# EasyEDA Pro project MicroMouse_v02.eprj, board PCB1
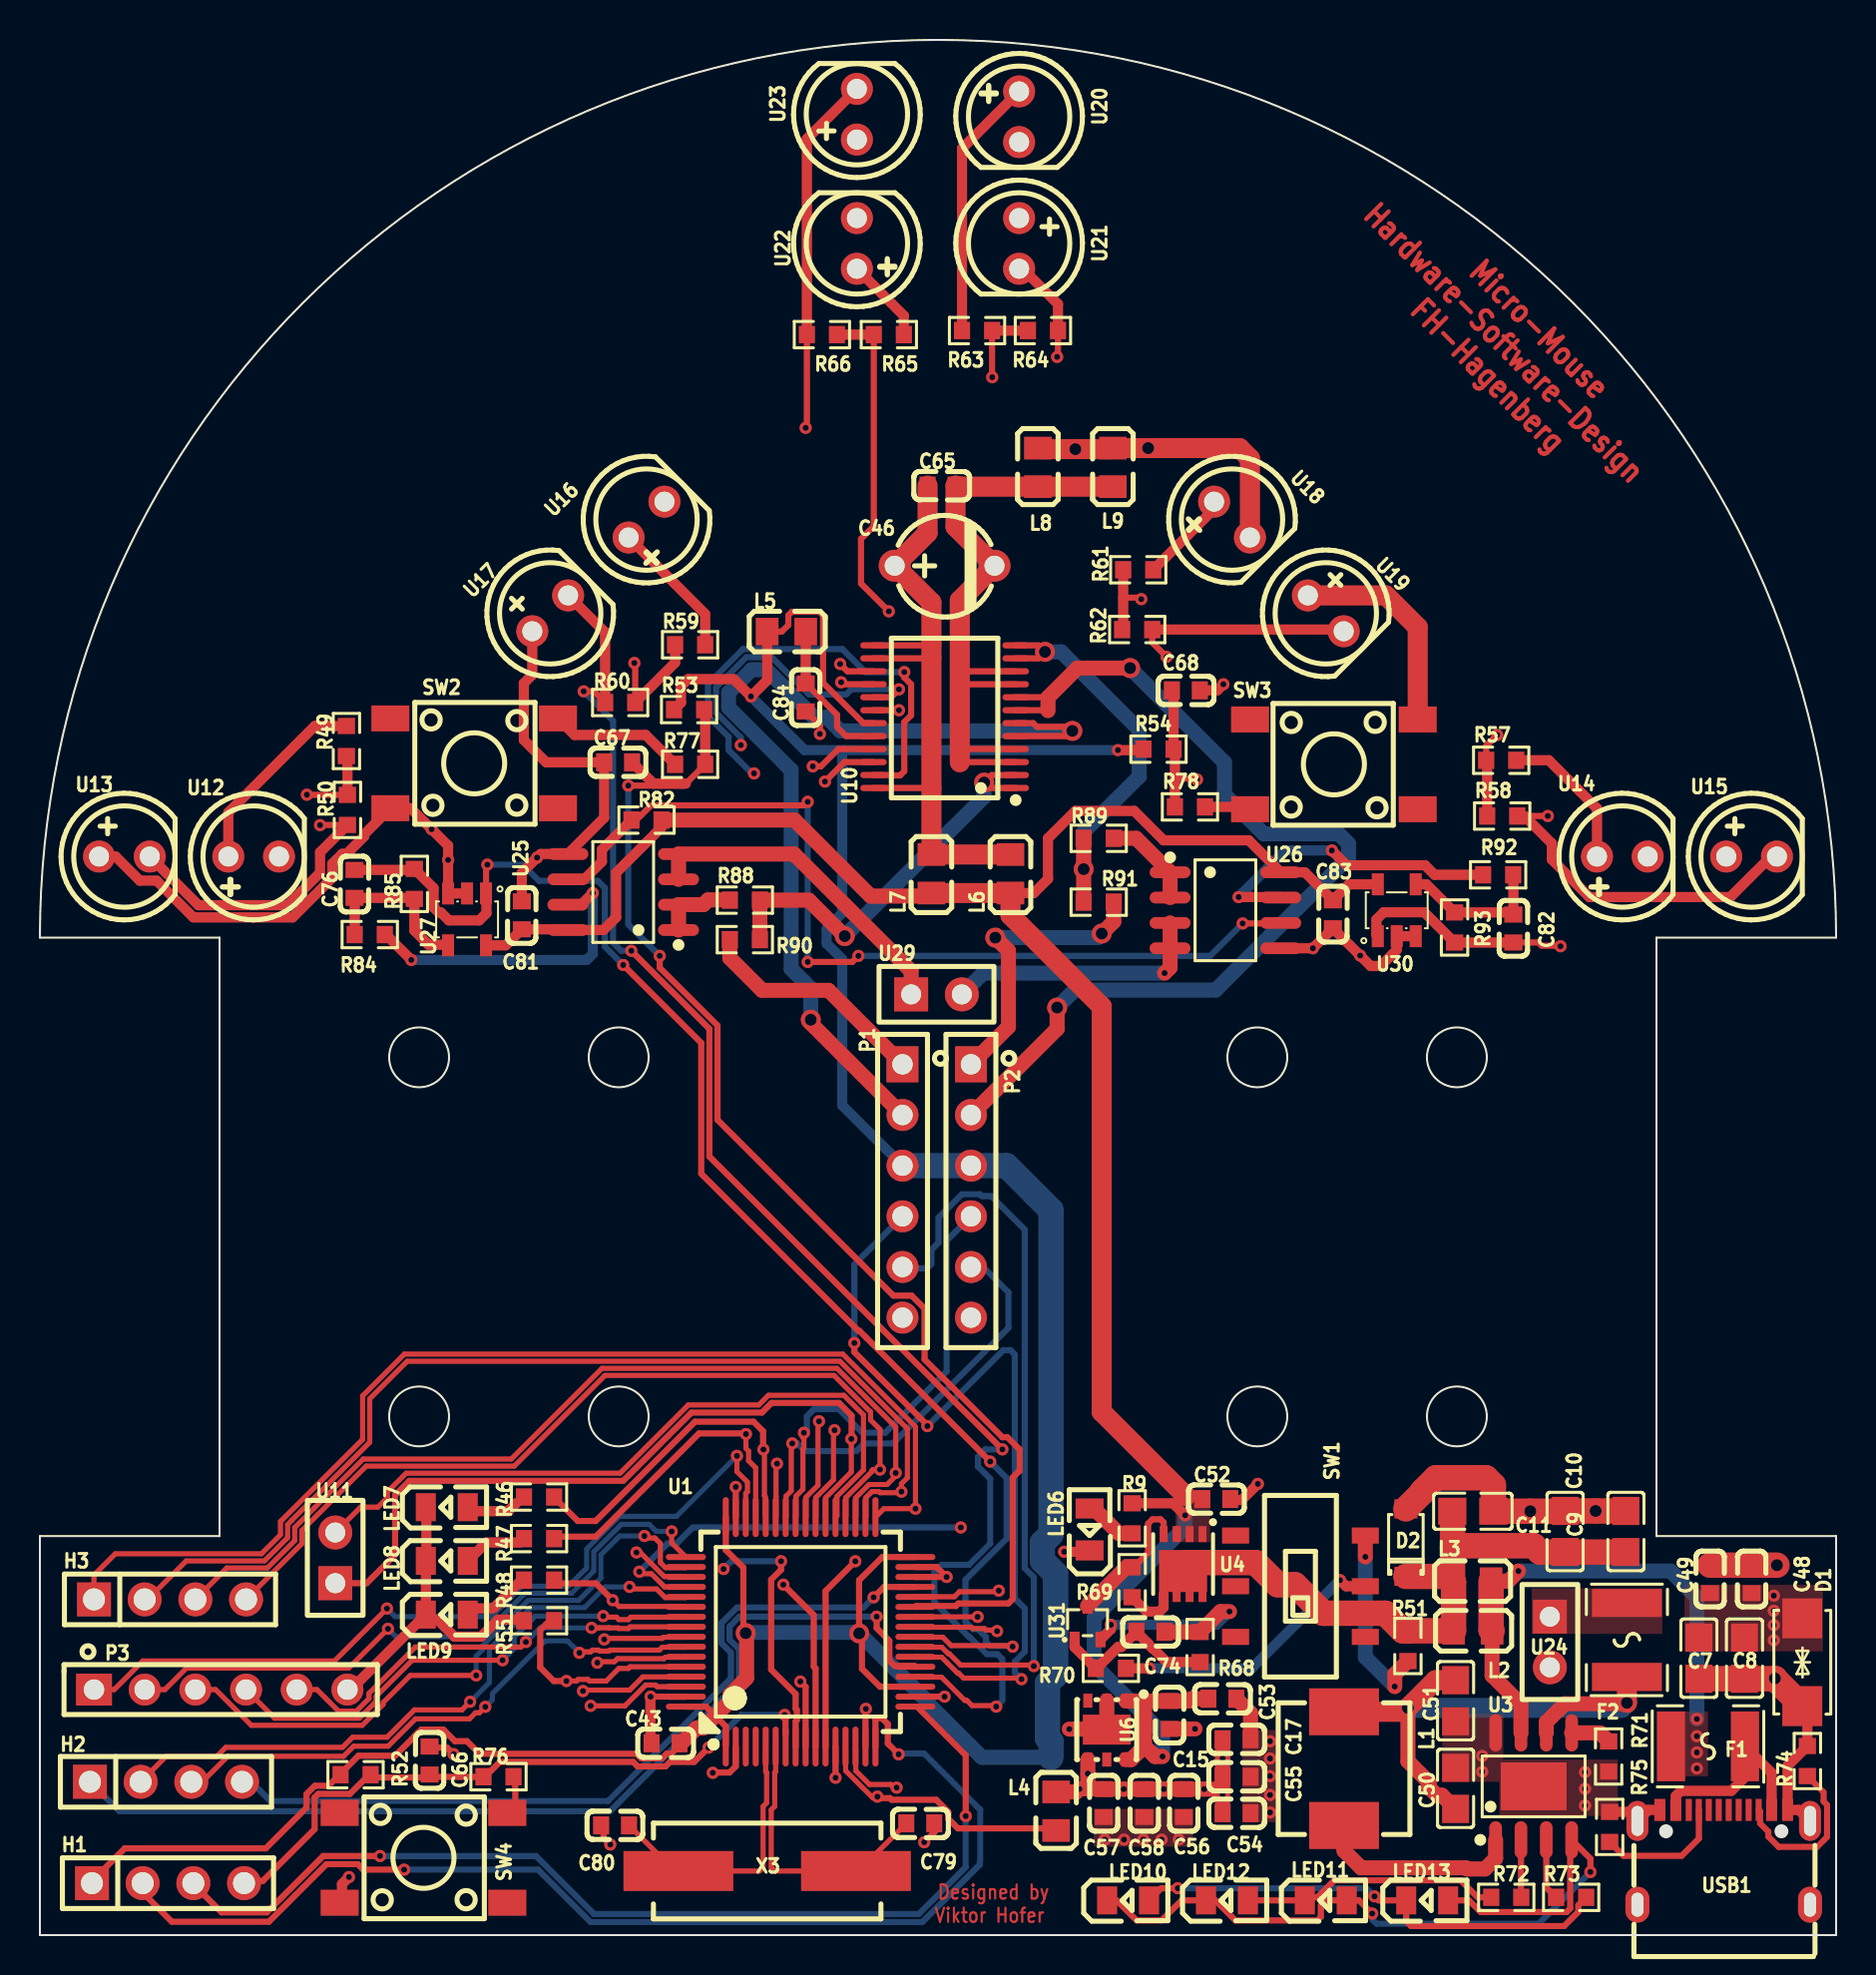
[diagram p4: board, top side]
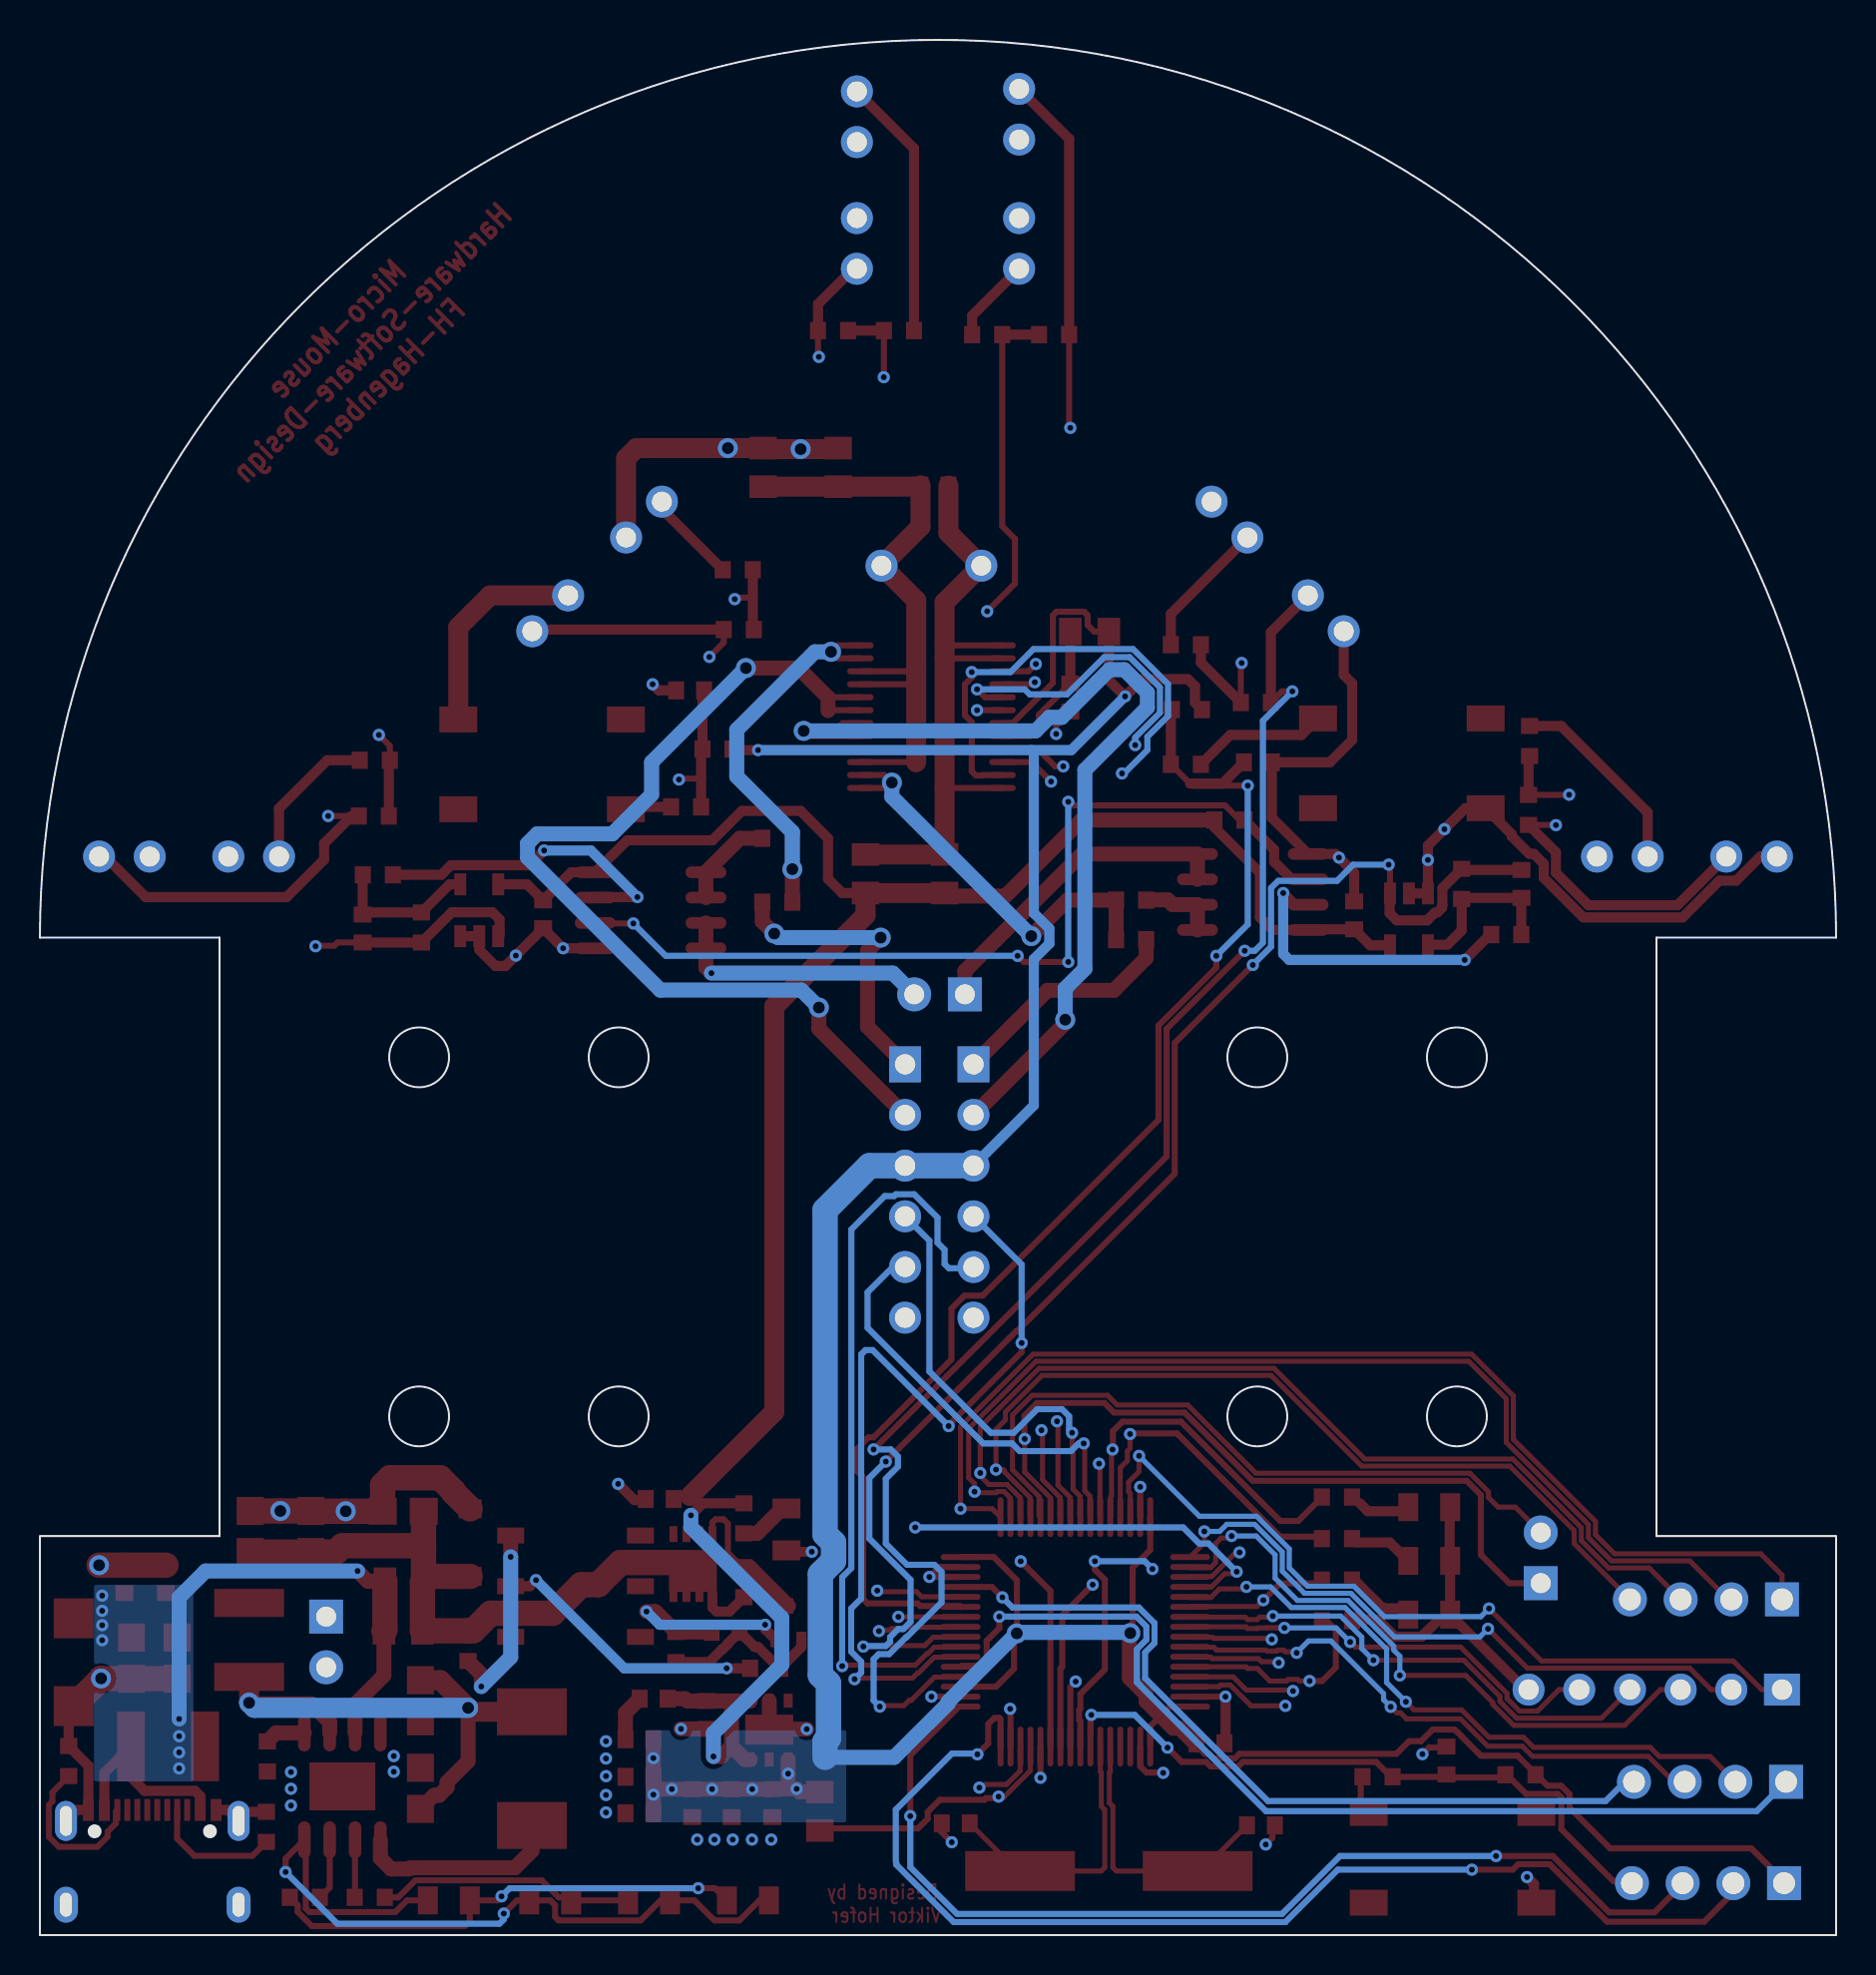
[diagram p5: board, bottom side, seen from below]

Outline 90 x 95 mm; copper layers: Top Layer, Inner1, Inner2, Bottom Layer. Coordinates in mm from the lower left corner of the outline.
Outline path: circle c19,44 r1.5 ; circle c19,26 r1.5 ; circle c29,44 r1.5 ; circle c29,26 r1.5 ; circle c61,44 r1.5 ; circle c61,26 r1.5 ; circle c71,44 r1.5 ; circle c71,26 r1.5 ; 0,50 9,50 9,20 0,20 0,0 90,0 90,20 81,20 81,50 90,50 arc(45,95) 0,50
Stack: Top Layer 0.035mm Outer layer copper thickness 1oz / Dielectric1 0.2104mm 7628 RC49% 8.6mil / Inner1 0.0152mm Inner layer copper thickness / Dielectric2 1.065mm 1.1mm H/HOZ Copper / Inner2 0.0152mm Inner layer copper thickness / Dielectric3 0.2104mm 7628 RC49% 8.6mil / Bottom Layer 0.035mm Outer layer copper thickness 1oz

## Design rules (mm)
net OSC_8M_O2: DP1
net OSC_8M_O1: DP1
template: JLCPCB Capability(Two Layers Board)
spacing copperThickness1oz (default): track to track 0.102, other pairs 0.152 to 0.3
spacing copperThickness2oz: track to track 0.203, other pairs 0.152 to 0.3
track width copperThickness1oz (default): min 0.127, default 0.254, max 2.54
track width copperThickness2oz: min 0.203, default 0.254, max 2.54
differential pair differentialPair (default): width min 0.127, default 0.254, max 2.54; gap min 0.152, default 0.152
via viaSize (default): diameter min 0.5, default 0.61, max 10; hole min 0.3, default 0.305, max 6.3

## Placement (name value [footprint] x y rotation side)
C7  10uF  [C0805]  83.13 13.88 90 top
C8  10uF  [C0805]  85.41 13.88 90 top
C9  10uF  [C0805]  79.47 20.23 270 top
C10  10uF  [C0805]  76.42 20.23 270 top
C11  10uF  [C0805]  71.8 21.25 180 top
C15  1uF  [C0603]  56.61 11.04 90 top
C17  1uF  [C0603]  59.96 9.82 180 top
C43  1uF  [C0603]  31.35 9.62 180 top
C46  10uF  [CAP-TH_BD5.0-P5.00-D1.0-FD]  45.33 68.64 0 top
C48  100nF  [C0603]  85.77 17.84 270 top
C49  100nF  [C0603]  83.68 17.84 270 top
C50  10uF  [C0805]  70.93 7.36 270 top
C51  10uF  [C0805]  70.93 11.75 90 top
C52  100nF  [C0603]  58.94 21.86 180 top
C53  100nF  [C0603]  59.25 11.85 180 top
C54  100nF  [C0603]  59.96 6.11 180 top
C55  100nF  [C0603]  59.96 7.94 180 top
C56  100nF  [C0603]  57.32 6.62 90 top
C57  100nF  [C0603]  53.31 6.62 90 top
C58  100nF  [C0603]  55.34 6.62 90 top
C65  100nF  [C0603]  45.18 72.66 180 top
C66  100nF  [C0603]  19.52 8.75 270 top
C67  100nF  [C0603]  28.97 58.79 0 top
C68  100nF  [C0603]  57.42 62.39 180 top
C74  10nF  [C0603]  55.64 15.2 180 top
C76  100pF  [C0603]  15.76 52.69 90 top
C79  20pF  [C0603]  44.11 5.6 180 top
C80  20pF  [C0603]  28.82 5.5 0 top
C81  100pF  [C0603]  24.15 51.12 90 top
C82  100pF  [C0603]  73.83 50.46 270 top
C83  100pF  [C0603]  64.79 51.17 270 top
C84  100nF  [C0603]  38.37 62.04 90 top
D1  SMAJ20CA  [SMA_L4.3-W2.6-LS5.2-BI]  88.31 13.68 90 top
D2  MMSZ4689  [SOD-123_L2.8-W1.8-LS3.7-RD]  68.44 19.67 90 top
F1  ASMD1812-300  [F1812]  83.58 9.46 180 top
F2  ASMD1812-300  [F1812]  79.52 14.8 90 top
H1  2.54-1*4P  [HDR-TH_4P-P2.54-V-F]  6.42 2.6 0 top
H2  2.54-1*4P  [HDR-TH_4P-P2.54-V-F]  6.32 7.68 0 top
H3  2.54-1*4P  [HDR-TH_4P-P2.54-V-F]  6.52 16.83 0 top
L1  1uH  [IND-SMD_L7.2-W6.6_GPSR0730]  65.35 8.34 270 top
L2  CBW201209U601T  [L0805]  71.8 15.25 180 top
L3  CBW201209U601T  [L0805]  71.75 17.74 180 top
L4  CBW201209U601T  [L0805]  50.92 6.21 270 top
L5  CBW201209U601T  [L0805]  37.41 65.34 180 top
L6  CBW201209U601T  [L0805]  48.63 53.2 90 top
L7  CBW201209U601T  [L0805]  44.67 53.2 90 top
L8  CBW201209U601T  [L0805]  50 73.57 270 top
L9  CBW201209U601T  [L0805]  53.76 73.57 270 top
LED6  XL-2012SURC  [LED0805-R-RD]  52.59 20.33 90 top
LED7  XL-2012SURC  [LED0805-R-RD]  20.39 21.45 0 top
LED8  XL-2012SURC  [LED0805-R-RD]  20.39 18.76 0 top
LED9  XL-2012SURC  [LED0805-R-RD]  20.39 16.07 0 top
LED10  XL-2012SURC  [LED0805-R-RD]  54.53 1.74 0 top
LED11  XL-2012SURC  [LED0805-R-RD]  64.43 1.74 0 top
LED12  XL-2012SURC  [LED0805-R-RD]  59.48 1.74 0 top
LED13  XL-2012SURC  [LED0805-R-RD]  69.51 1.74 0 top
P1  2.54-1*6P  [HDR-TH_6P-P2.54-V-F]  43.22 37.3 270 top
P2  2.54-1*6P  [HDR-TH_6P-P2.54-V-F]  46.65 37.3 270 top
P3  2.54-1*6P  [HDR-TH_6P-P2.54-V-F]  9.06 12.31 0 top
R9  10K  [R0603]  54.73 20.89 90 top
R46  10K  [R0603]  25.01 21.96 0 top
R47  10K  [R0603]  25.01 19.88 0 top
R48  10K  [R0603]  25.01 17.79 0 top
R49  150Ω  [R0603]  15.36 59.85 90 top
R50  10K  [R0603]  15.41 56.4 270 top
R51  10K  [R0603]  68.55 14.49 90 top
R52  10K  [R0603]  15.82 8.04 180 top
R53  10K  [R0603]  32.53 61.43 180 top
R54  10K  [R0603]  56.05 59.45 180 top
R55  10K  [R0603]  25.01 15.76 180 top
R57  150Ω  [R0603]  73.22 58.89 0 top
R58  10K  [R0603]  73.27 56.1 0 top
R59  150Ω  [R0603]  32.58 64.68 0 top
R60  10K  [R0603]  29.07 61.79 180 top
R61  150Ω  [R0603]  55.03 68.44 0 top
R62  10K  [R0603]  54.98 65.44 0 top
R63  150Ω  [R0603]  46.96 80.43 180 top
R64  10K  [R0603]  50.26 80.43 0 top
R65  150Ω  [R0603]  42.54 80.23 0 top
R66  10K  [R0603]  39.18 80.23 180 top
R68  100kΩ  [R0603]  58.13 14.44 270 top
R69  100kΩ  [R0603]  54.73 17.69 270 top
R70  1kΩ  [R0603]  53.66 13.37 180 top
R71  56kΩ  [R0603]  78.6 8.95 90 top
R72  1kΩ  [R0603]  73.47 1.89 180 top
R73  1kΩ  [R0603]  76.72 1.89 0 top
R74  5.1kΩ  [R0603]  88.56 8.72 270 top
R75  5.1kΩ  [R0603]  78.66 5.42 270 top
R76  1kΩ  [R0603]  22.98 7.94 0 top
R77  1kΩ  [R0603]  32.58 58.69 180 top
R78  1kΩ  [R0603]  57.62 56.55 0 top
R82  4.7kΩ  [R0603]  30.39 55.89 0 top
R84  10K  [R0603]  16.53 50.15 0 top
R85  22kΩ  [R0603]  18.76 52.69 90 top
R88  0Ω  [R0603]  35.32 51.88 180 top
R89  0Ω  [R0603]  53.05 54.98 0 top
R90  0Ω  [R0603]  35.32 49.9 180 top
R91  0Ω  [R0603]  53.05 51.78 0 top
R92  10K  [R0603]  73.07 53.15 180 top
R93  22kΩ  [R0603]  70.88 50.51 270 top
SW1  SS-3235S-L3  [SW-SMD_SS-3235S-L3.00]  63.16 17.49 270 top
SW2  TS-1002S-04326C  [KEY-SMD_4P-L6.0-W6.0-P4.50-LS9.0]  21.76 58.74 180 top
SW3  TS-1002S-04326C  [KEY-SMD_4P-L6.0-W6.0-P4.50-LS9.0]  64.84 58.69 0 top
SW4  TS-1002S-04326C  [KEY-SMD_4P-L6.0-W6.0-P4.50-LS9.0]  19.22 3.87 180 top
U1  STM32F446RET6  [LQFP-64_L10.0-W10.0-P0.50-LS12.0-BL]  38.12 15.2 0 top
U3  ETA9740E8A  [ESOP-8_L4.9-W3.9-P1.27-LS6.0-BL-EP-1]  74.85 7.45 0 top
U4  AON7403  [DFN-8_L3.0-W3.0-P0.65-BL]  57.28 18.6 180 top
U6  LD39050PU33R  [DFN-6_L3.0-W3.0-P0.95-LS3.1-TL-EP]  53.46 10.27 270 top
U10  TB6612FNG,C,8,EL  [SSOP-24_L8.3-W5.6-P0.65-LS7.6-BL]  45.33 61.07 90 top
U11  ZX-PM2.54-1-2PY  [HDR-TH_2P-P2.54-V-F]  14.8 18.91 90 top
U12  HIR7373C  [LED-TH_BD5.0-P2.54-L-RD]  10.71 54.06 180 top
U13  DY-PD333-3B-L3  [LED-TH_BD5.0-P2.54-FD]  4.23 54.06 0 top
U14  HIR7373C  [LED-TH_BD5.0-P2.54-L-RD]  79.29 54.06 180 top
U15  DY-PD333-3B-L3  [LED-TH_BD5.0-P2.54-FD]  85.77 54.06 0 top
U16  HIR7373C  [LED-TH_BD5.0-P2.54-L-RD]  30.39 70.95 225 top
U17  DY-PD333-3B-L3  [LED-TH_BD5.0-P2.54-FD]  25.57 66.26 45 top
U18  HIR7373C  [LED-TH_BD5.0-P2.54-L-RD]  59.73 70.95 135 top
U19  DY-PD333-3B-L3  [LED-TH_BD5.0-P2.54-FD]  64.43 66.26 315 top
U20  HIR7373C  [LED-TH_BD5.0-P2.54-L-RD]  49.06 91.15 90 top
U21  DY-PD333-3B-L3  [LED-TH_BD5.0-P2.54-FD]  49.06 84.8 270 top
U22  HIR7373C  [LED-TH_BD5.0-P2.54-L-RD]  40.94 84.8 270 top
U23  DY-PD333-3B-L3  [LED-TH_BD5.0-P2.54-FD]  40.94 91.27 90 top
U24  ZX-PM2.54-1-2PY  [HDR-TH_2P-P2.54-V-F]  75.66 14.69 270 top
U25  ACS722LLCTR-05AB-T  [SOIC-8_L4.9-W3.9-P1.27-LS6.0-BL]  29.23 52.29 90 top
U26  ACS722LLCTR-05AB-T  [SOIC-8_L4.9-W3.9-P1.27-LS6.0-BL]  59.4 51.37 270 top
U27  OPA344NA/250  [SOT-23-5_L3.0-W1.7-P0.95-LS2.8-BR]  21.4 50.91 90 top
U29  ZX-PM2.54-1-2PY  [HDR-TH_2P-P2.54-V-F]  44.92 47.15 0 top
U30  OPA344NA/250  [SOT-23-5_L3.0-W1.7-P0.95-LS2.8-BR]  67.99 51.37 270 top
U31  SI1304BDL  [SOT-323-3_L2.0-W1.3-P1.30-LS2.1-BL]  52.49 15.66 0 top
USB1  TYPE-C 16PIN 2MD(073)  [USB-C-SMD_TYPE-C-6PIN-2MD-073]  84.37 3.9 0 top
X3  8MHz  [CRYSTAL-SMD_L11.5-W4.8-LS12.7]  36.44 3.21 0 top

## Footprints (pads in the part's own frame, mm; a bottom-side part is the same pattern mirrored in y, then rotated)
C0603
  rect 0.8x0.9 smd: 1(-0.7,0) 2(0.7,0)
C0805
  rect 1.41x1.35 smd: 1(-1.03,0) 2(1.03,0)
CAP-TH_BD5.0-P5.00-D1.0-FD
  round 1.6 hole 1: 1(-2.5,0) 2(2.5,0)
CRYSTAL-SMD_L11.5-W4.8-LS12.7
  rect 5.5x2 smd: 1(-4.45,0) 2(4.45,0)
DFN-6_L3.0-W3.0-P0.95-LS3.1-TL-EP
  rect 0.701x0.45 smd: 1(-1.476,0.95) 2(-1.476,0) 3(-1.476,-0.95) 4(1.476,-0.95) 5(1.476,0) 6(1.476,0.95)
  rect 1.5x2.4 smd: 7(-0.025,0)
DFN-8_L3.0-W3.0-P0.65-BL
  rect 0.4x0.8 smd: 1(-0.975,-1.5) 2(-0.325,-1.5) 3(0.325,-1.5) 4(0.975,-1.5) 5(0.975,1.5) 6(0.325,1.5) 7(-0.325,1.5) 8(-0.975,1.5)
  rect 2.4x2.1 smd: 9(0,0.35)
ESOP-8_L4.9-W3.9-P1.27-LS6.0-BL-EP-1
  oval 0.63x1.865 smd: 1(-1.905,-2.683) 2(-0.635,-2.683) 3(0.635,-2.683) 4(1.905,-2.683) 5(1.905,2.683) 6(0.635,2.683) 7(-0.635,2.683) 8(-1.905,2.683)
  rect 3.3x2.4 smd: 9(0,0)
F1812
  rect 1.407x3.499 smd: 1(-1.853,0) 2(1.853,0)
HDR-TH_2P-P2.54-V-F
  rect 1.7x1.7 hole 1: 1(-1.27,0)
  round 1.7 hole 1: 2(1.27,0)
HDR-TH_4P-P2.54-V-F
  rect 1.7x1.7 hole 1.1: 1(-3.81,0)
  round 1.7 hole 1.1: 2(-1.27,0) 3(1.27,0) 4(3.81,0)
HDR-TH_6P-P2.54-V-F
  rect 1.8x1.6 hole 1.02: 1(-6.35,0)
  round 1.6 hole 1.02: 2(-3.81,0) 3(-1.27,0) 4(1.27,0) 5(3.81,0) 6(6.35,0)
IND-SMD_L7.2-W6.6_GPSR0730
  rect 2.35x3.5 smd: 1(-2.85,0) 2(2.85,0)
KEY-SMD_4P-L6.0-W6.0-P4.50-LS9.0
  rect 1.9x1.3 smd: 1(-4.2,2.25) 2(4.2,2.25) 3(-4.2,-2.25) 4(4.2,-2.25)
L0805
  rect 1.133x1.377 smd: 1(-0.966,0) 2(0.966,0)
LED0805-R-RD
  rect 1x1.399 smd: 1(1.05,0) 2(-1.05,0)
LED-TH_BD5.0-P2.54-FD
  round 1.6 hole 1: 1(-1.27,0) 2(1.27,0)
LED-TH_BD5.0-P2.54-L-RD
  round 1.6 hole 1: 1(-1.27,0) 2(1.27,0)
LQFP-64_L10.0-W10.0-P0.50-LS12.0-BL
  oval 0.3x2 smd: 1(-3.75,-5.75) 2(-3.25,-5.75) 3(-2.75,-5.75) 4(-2.25,-5.75) 5(-1.75,-5.75) 6(-1.25,-5.75) 7(-0.75,-5.75) 8(-0.25,-5.75) 9(0.25,-5.75) 10(0.75,-5.75) 11(1.25,-5.75) 12(1.75,-5.75) 13(2.25,-5.75) 14(2.75,-5.75) 15(3.25,-5.75) 16(3.75,-5.75) 33(3.75,5.75) 34(3.25,5.75) 35(2.75,5.75) 36(2.25,5.75) 37(1.75,5.75) 38(1.25,5.75) 39(0.75,5.75) 40(0.25,5.75) 41(-0.25,5.75) 42(-0.75,5.75) 43(-1.25,5.75) 44(-1.75,5.75) 45(-2.25,5.75) 46(-2.75,5.75) 47(-3.25,5.75) 48(-3.75,5.75)
  oval 2x0.3 smd: 17(5.75,-3.75) 18(5.75,-3.25) 19(5.75,-2.75) 20(5.75,-2.25) 21(5.75,-1.75) 22(5.75,-1.25) 23(5.75,-0.75) 24(5.75,-0.25) 25(5.75,0.25) 26(5.75,0.75) 27(5.75,1.25) 28(5.75,1.75) 29(5.75,2.25) 30(5.75,2.75) 31(5.75,3.25) 32(5.75,3.75) 49(-5.75,3.75) 50(-5.75,3.25) 51(-5.75,2.75) 52(-5.75,2.25) 53(-5.75,1.75) 54(-5.75,1.25) 55(-5.75,0.75) 56(-5.75,0.25) 57(-5.75,-0.25) 58(-5.75,-0.75) 59(-5.75,-1.25) 60(-5.75,-1.75) 61(-5.75,-2.25) 62(-5.75,-2.75) 63(-5.75,-3.25) 64(-5.75,-3.75)
R0603
  rect 0.806x0.864 smd: 1(-0.753,0) 2(0.753,0)
SMA_L4.3-W2.6-LS5.2-BI
  rect 2x2 smd: 1(-2.2,0) 2(2.2,0)
SOD-123_L2.8-W1.8-LS3.7-RD
  rect 0.95x1.15 smd: 1(-1.692,0) 2(1.692,0)
SOIC-8_L4.9-W3.9-P1.27-LS6.0-BL
  oval 0.588x2.045 smd: 1(-1.905,-2.772) 2(-0.635,-2.772) 3(0.635,-2.772) 4(1.905,-2.772) 5(1.905,2.772) 6(0.635,2.772) 7(-0.635,2.772) 8(-1.905,2.772)
SOT-23-5_L3.0-W1.7-P0.95-LS2.8-BR
  rect 1.1x0.6 smd: 1(1.3,-0.95) 2(1.3,0) 3(1.3,0.95) 4(-1.3,0.95) 5(-1.3,-0.95)
SOT-323-3_L2.0-W1.3-P1.30-LS2.1-BL
  rect 0.5x0.78 smd: 1(-0.65,-0.84) 2(0.65,-0.84) 3(0,0.84)
SSOP-24_L8.3-W5.6-P0.65-LS7.6-BL
  oval 0.308x1.324 smd: 1(-3.575,-3.562) 2(-2.925,-3.562) 3(-2.275,-3.562) 4(-1.625,-3.562) 5(-0.975,-3.562) 6(-0.325,-3.562) 7(0.325,-3.562) 8(0.975,-3.562) 9(1.625,-3.562) 10(2.275,-3.562) 11(2.925,-3.562) 12(3.575,-3.562) 13(3.575,3.562) 14(2.925,3.562) 15(2.275,3.562) 16(1.625,3.562) 17(0.975,3.562) 18(0.325,3.562) 19(-0.325,3.562) 20(-0.975,3.562) 21(-1.625,3.562) 22(-2.275,3.562) 23(-2.925,3.562) 24(-3.575,3.562)
SW-SMD_SS-3235S-L3.00
  rect 0.8x1.35 smd: 1(-2.54,3.25) 2(0,3.25) 3(2.54,3.25) 4(-2.54,-3.25) 5(0,-3.25) 6(2.54,-3.25)
USB-C-SMD_TYPE-C-6PIN-2MD-073
  rect 0.55x1.1 smd: 1(-3.2,2.375) 2(-2.4,2.375) 11(2.4,2.375) 12(3.2,2.375)
  rect 0.3x1.1 smd: 3(-1.75,2.375) 4(-1.25,2.375) 5(-0.75,2.375) 6(-0.25,2.375) 7(0.25,2.375) 8(0.75,2.375) 9(1.25,2.375) 10(1.75,2.375)
  oval 1.1x2 hole 0.6x1.5: 13(-4.325,1.825) 14(4.325,1.825)
  oval 1.2x1.8 hole 0.6x1.2: 13(-4.325,-2.375) 14(4.325,-2.375)

## Nets
As in the schematic.

Pads without a net: SW1 3 4 5 6; SW2 1 4; SW3 1 4; SW4 1 4; U6 3 5; USB1 3 5 6 7 8 9

## Via types
v1: diameter 0.61, hole 0.305, Top Layer to Bottom Layer, 165 vias
v2: diameter 1, hole 0.6, Top Layer to Bottom Layer, 20 vias

## Routing (per net, layer and track width the routed paths; a pad name or vN(x,y) marks a point on that pad's centre or on a via; arc(x,y) is an arc through that point)
5V_UP: length 25.4
  Top Layer w0.75: v1(74.08,18.25) 73.58,17.74 72.71,17.74 ; L2.1 72.76,13.02 74.21,11.57 U3.7
  Top Layer w1.27: L2.1 72.71,15.3 72.71,17.74
  Bottom Layer w0.75: v1(83.02,10.83) 83.02,16.93 81.7,18.25 v1(74.08,18.25)
  vias: v1(83.02,9.97) v1(83.02,9.16) v1(83.02,8.35) v1(86.88,17.02) v1(86.88,16.26) v1(86.88,15.54) v1(86.88,14.78)
+3V3: length 190.6
  Top Layer w0.305: U10.19 41.26,60.75 39.24,62.77 39.24,66.16 39.06,66.33 37.68,66.33 37.5,66.16 37.5,65.67 37.18,65.34 L5.2 ; 14.87,7.9 14.46,7.48 13.77,7.48 13.36,7.07 13.36,6.39 11.32,4.35 4.25,4.35 2.95,3.05 ; 31.95,9.41 31.63,9.09 31.4,9.09 31.17,8.86 30.12,8.86 29.89,9.09 22.03,9.09 21.4,9.72 20.8,9.72 20.22,10.3 19.11,10.3 18.96,10.16 18.95,10.16 18.77,9.98 18.77,9.96 17.8,8.99 15.96,8.99 15.15,8.18 ; 41.19,14.92 41.19,13.35 42.09,12.45 43.86,12.45 ; 35.25,15.3 35.25,18.42 34.37,19.3 34.37,20.94 ; 43.86,18.95 42.21,18.95 41.05,17.79 41.05,15.19 ; 34.37,9.53 34.37,10.46 33.38,11.45 U1.64
  Top Layer w0.508: R54.2 55.25,59.4 v1(54.02,59.4) ; R53.2 32.12,61.78 32.12,62.6 32.48,62.96 34.76,62.96 v1(35.63,62.09) 36.44,62.9 L5.2
  Top Layer w0.75: 32.05,9.53 32.9,10.37 33.23,10.37 34.57,11.72 34.57,12.05 35.41,12.89 35.41,15.04 ; C17.2 v1(59.26,8.87) C55.2 59.26,7.31 ; 52.51,8.8 v1(52.51,8.1) 52.51,7.36 52.54,7.33 ; L4.1 51.94,7.18 v1(52.09,7.33) 52.54,7.33 ; 52.54,7.33 53.29,7.33 C57.2 v1(54.31,7.32) C58.2 v1(56.32,7.32) C56.2 v1(58.34,7.32) 59.25,7.32 59.26,7.31 ; 59.26,7.31 C54.2
  Bottom Layer w0.508: 40.33,59.4 40.2,59.27 40.2,51.23 39.42,50.45 39.42,49.7 40.2,48.92 40.2,41.59 P1.3 ; 40.33,59.4 38.32,59.4 v1(35.63,62.09) ; 40.33,59.4 v1(54.02,59.4)
  Bottom Layer w0.75: 41.01,15.17 35.36,15.17 35.34,15.15 ; 41.02,15.16 44.5,11.68 44.5,11.61 47.2,8.91 50.66,8.91
  Bottom Layer w1.27: 50.66,8.91 50.66,9.7 50.49,9.87 50.49,12.63 50.89,13.03 50.89,18.1 50.23,18.76 50.23,19.67 50.66,20.1 50.66,36.34 48.43,38.57 P2.3 P1.3
  vias: v1(59.26,7.04) v2(35.36,15.14) v2(41.05,15.12)
+5V: length 116.5
  Top Layer w0.508: R9.2 56.78,21.64 v1(57.38,21.04) ; U30.5 65.59,52.67 C83.1 63.38,53.28 U26.8 60.57,54.88 56.3,54.88 54.83,56.35 51.88,56.35 50.51,54.98 50.51,52.95 49.8,52.23 L6.1 ; R82.2 31.15,55.53 28.87,53.25 28.87,51.02 28.24,50.38 U25.8 26.42,50.42 C81.1 23.34,49.61 U27.5
  Top Layer w0.75: R82.2 37.81,55.89 41.62,52.08 44.52,52.08 L7.1 ; v1(56.25,8.95) 55.86,8.95 55.35,9.47 ; U6.1 54.42,11.74 55.35,11.74 ; C53.2 57.67,11.85 57.56,11.74 C15.2 55.35,11.74 ; 55.35,9.47 54.67,8.8 U6.6 ; 55.35,9.47 55.35,11.74
  Top Layer w1.001: 57.42,22.01 53.2,26.23 53.2,46.55 48.63,51.12 L6.1 L7.1
  Bottom Layer w0.75: v1(56.25,8.95) 56.25,10.12 52.83,13.54 52.83,15.9 57.38,20.45 v1(57.38,21.04)
+5V_MOT: length 32.6
  Top Layer w0.305: 44.67,57.47 44.64,57.5 U10.24 ; 44.67,64.67 44.65,64.65 U10.13 ; 44.67,64.04 44.63,64 U10.14
  Top Layer w1.001: L6.2 L7.2 44.67,66.8 C46.1 44.48,70.29 C65.2
AGND: length 34.1
  Top Layer w0.305: 48.89,63.35 46.13,63.35 46.09,63.39 ; 48.89,59.45 46.15,59.45 46.09,59.51 ; 46.35,58.74 46.41,58.8 48.89,58.8 ; 48.89,62.7 46.35,62.7
  Top Layer w1.001: 46.09,58.79 46.09,66.91 C46.2 45.88,70.6 C65.1 45.93,72.6 L8.2 L9.2
GND: length 168.6
  Top Layer w0.305: 28.24,5.36 28.24,4.88 v1(28.58,4.54) ; v1(20.73,9.07) 20.4,9.4 19.74,9.4 ; 44.84,5.62 44.84,5.19 v1(44.31,4.66) ; C84.1 39.08,60.63 v1(39.08,60.21) ; U1.63 v1(30.6,11.95) ; U1.12 v1(39.87,7.89) ; U1.30 v1(45.43,17.95) 44.93,18.45 U1.31 ; U10.18 v1(43.04,61.4) ; U1.47 v1(34.87,22.47) ; U1.18 v1(45.33,11.95)
  Top Layer w0.5: LED6.2 52.53,19.21 v1(51.32,19.21)
  Top Layer w0.508: P3.6 15.58,12.31 LED9.2 ; U31.2 53.66,15.34 v1(53.66,15.56) ; 59.9,21.81 60.21,21.81 v1(61.03,22.62) ; U13.1 3.8,54.06 5,52.86 5.85,52.86 7.69,51.02 12.66,51.02 14.65,53 14.65,53.7 15.15,54.2 15.37,54.2 16.25,55.08 16.25,55.18 SW2.2 18.57,56.49 v1(19.63,55.44) 20.45,54.61 v1(20.45,53.89) U27.3 U27.2 ; v1(15.49,2.91) 15.14,2.56 15.14,1.81 ; U17.1 24.67,63.17 24.25,62.75 24.25,59.91 25.37,58.79 C67.1 28.27,56.01 U25.5 25.09,54.19 v1(24.91,54.01) 24.15,53.25 C81.2 ; 24.08,15.81 22.96,15.81 22.11,14.96 20.77,14.96 19.92,15.81 19.76,15.81 ; U30.3 U30.2 67.99,49.39 67.17,48.58 66.68,48.58 v1(66.15,49.1) C83.2 v1(63.79,49.47) U26.5 ; 30.59,11.95 30.59,9.71 30.58,9.71 ; R75.1 79.59,6.18 USB1.13 80.6,6.27 USB1.1 ; 19.34,18.64 19.34,16.09 ; 19.36,21.44 19.36,18.7 19.34,18.67 ; C68.1 59,62.39 v1(59.3,62.7) ; 30.61,9.78 30.62,9.76 ; USB1.14 88.14,6.27 USB1.12 87.57,8.49 R74.1 88.56,11.22
  Top Layer w0.75: v1(59.61,16.22) 59.16,16.22 R68.1 56.35,15.19 C74.1 ; C15.1 v1(57.88,10.34) ; v1(51.58,10.32) 53.43,10.32 U6.7 U6.2 ; C53.1 60.66,11.14 C17.1
  Top Layer w1.001: 60.63,70.06 60.63,74.02 60.11,74.54 v2(55.53,74.54) 53.76,74.54 53.71,74.49 v2(51.88,74.49) 50.05,74.49 50,74.54 ; 69.04,60.94 69.04,65.56 67.44,67.15 U19.1
  Top Layer w1.27: v2(87.04,18.54) C48.1 C49.1 ; C7.1 C8.1 86.92,12.85 v2(86.94,12.86) 86.94,12.85 D1.1 ; C9.1 v2(77.95,21.26) C10.1 76.41,21.25 v2(74.68,21.25) C11.1 72.83,22.55 72.46,22.92 69.95,22.92 69.28,22.25 69.28,22.2 D2.2
  Bottom Layer w0.508: v1(59.61,16.22) 58.94,15.56 v1(53.66,15.56)
  vias: v1(53.36,4.79) v1(54.32,4.79) v1(55.29,4.79) v1(56.2,4.79) v1(57.07,4.79) v1(61.64,9.72) v1(61.64,8.85) v1(61.63,7.97) v1(61.64,7.02) v1(61.64,6.15) v1(72.27,8.98) v1(72.27,8.19) v1(77.42,8.17) v1(77.42,7.33) v1(77.42,6.5)
BOOT_O: length 10.3
  Top Layer w0.254: U1.60 29.57,13.45 29.49,13.37 29.01,13.37 28.37,12.74 27.54,12.74 27.45,12.82 26.97,12.82 26.89,12.74 v1(26.38,12.74)
  Top Layer w0.305: 25.42,15.64 25.07,15.29 25.07,13.42 25.75,12.74 v1(26.38,12.74)
BTN_02: length 65
  Top Layer w0.305: R77.1 32.27,57.62 v1(29.48,57.62) ; v1(31.06,49.09) 31.06,48.49 33.95,45.6 33.95,40.87 42.76,32.05 43.68,32.05 44.33,31.41 44.33,28.85 48.23,24.96 48.48,24.96 49.09,24.34 49.09,23.28 48.75,22.94 48.75,16.84 48.53,16.62 46.02,16.62 45.9,16.5 43.91,16.5 U1.27
  Top Layer w0.508: C67.2 30.74,57.72 32.37,57.72 ; R77.1 33.33,61.38 R53.1
  Bottom Layer w0.305: v1(29.48,57.62) 29.48,50.66 v1(31.06,49.09)
BTN_03: length 56.1
  Top Layer w0.254: v1(48.05,17.26) 47.99,17.21 46.07,17.21 45.82,16.96 43.93,16.96 43.92,16.95 U1.28
  Top Layer w0.305: 56.87,57.97 57.93,57.97 v1(57.98,57.92)
  Top Layer w0.508: C68.2 56.8,62.31 R54.1 56.87,59.38 R78.1
  Inner2 w0.305: v1(48.05,17.26) 57.98,27.2 v1(57.98,57.92)
CRS_O1: length 71.4
  Top Layer w0.254: v1(48.74,14.46) 48.69,14.51 45.66,14.51 45.24,14.93 43.94,14.93 43.92,14.95 U1.24
  Top Layer w0.305: v1(22.42,53.66) 22.35,53.59 U27.1 ; v1(29.23,48.63) 33.14,44.72 33.14,38.16 41.01,30.29 41.06,30.29 41.42,29.93 v1(47.62,23.74)
  Top Layer w0.508: U27.1 22.37,52.2 22.37,51.22 22.01,50.86 20.49,50.86 20.09,51.26 19.99,51.26 19.75,51.5 19.75,51.6 19.73,51.63 19.73,52.48 R85.2 18.71,53.39 C76.2
  Bottom Layer w0.305: v1(47.62,23.74) 48.44,22.91 48.44,19.88 46.38,17.81 46.38,15.7 46.73,15.34 46.99,15.34 47.4,14.94 47.4,14.71 47.62,14.49 48.71,14.49 v1(48.74,14.46) ; v1(29.23,48.63) 28.31,49.54 28.31,52.49 27.95,52.84 25.01,52.84 24.2,53.66 v1(22.42,53.66)
CRS_O2: length 75.9
  Top Layer w0.254: U1.25 43.97,15.45 43.99,15.43 46.68,15.43 46.74,15.37 47.33,15.37 47.41,15.29 47.91,15.29 v1(47.96,15.24)
  Top Layer w0.305: v1(76.19,49.57) 76.17,49.59 75.25,49.59 75.09,49.76 C82.2
  Top Layer w0.508: C82.2 73.83,49.75 R93.2 69.37,51.27 67.33,51.27 66.97,50.91 66.97,50.14 U30.1
  Inner2 w0.305: v1(47.96,15.24) 48.91,15.24 52.3,11.85 52.3,11.04 52.51,10.83 56.93,10.83 57.56,11.45 59.66,11.45 65.8,17.59 65.8,19.21 66.16,19.57 67.38,19.57 77.18,29.37 77.18,48.58 v1(76.19,49.57)
CRS_VIOUT1: length 15.6
  Top Layer w0.508: 17.28,50.15 17.34,50.15 v1(18.61,48.88) ; v1(27.7,52.23) 27.12,51.65 U25.7
  Bottom Layer w0.508: v1(27.7,52.23) 27.7,49.19 27.4,48.88 v1(18.61,48.88)
CRS_VIOUT2: length 15.8
  Top Layer w0.508: v1(64.74,54.37) 65.48,53.63 69.41,53.63 69.88,53.15 R92.2 ; U26.7 62.15,52.03 v1(60.06,52.03)
  Bottom Layer w0.508: v1(60.06,52.03) 62.4,54.37 v1(64.74,54.37)
ENC_OUT_A1: length 41.7
  Top Layer w0.254: v1(49.18,12.83) 49.13,12.88 46.29,12.88 46.04,13.13 45.99,13.13 45.18,13.93 43.94,13.93 43.92,13.95 U1.22
  Top Layer w0.305: v1(40.81,29.68) 40.81,29.22 44.47,25.56 v1(44.47,25.51)
  Bottom Layer w0.305: v1(49.18,12.83) 48.85,13.16 48.85,13.71 49.35,14.21 49.35,16.37 48.85,16.87 48.85,29.11 48.63,29.32 48.28,29.32 v1(44.47,25.51) ; P1.4 40.81,33.62 v1(40.81,29.68)
ENC_OUT_A2: length 22.5
  Top Layer w0.254: U1.41 37.87,21 37.89,21.02 37.89,22 38.23,22.35 38.23,24.35 38.28,24.4 38.28,24.89 38.23,24.94 38.23,25.13 v1(38.28,25.18)
  Bottom Layer w0.305: P2.4 45.43,34.81 45.43,28.26 42.35,25.18 41.21,25.18 40.02,26.36 38.79,26.36 38.43,26.01 38.43,25.33 v1(38.28,25.18)
ENC_OUT_B1: length 38
  Top Layer w0.254: U1.23 43.92,14.45 43.94,14.43 45.19,14.43 45.51,14.11 45.56,14.11 46.13,13.54 49.75,13.54 v1(49.8,13.49)
  Bottom Layer w0.305: v1(49.8,13.49) 49.8,17.94 49.34,18.39 49.34,35.37 47.67,37.05 47.2,37.05 47.11,37.13 46.19,37.13 45.03,35.97 45.03,34.71 44.67,34.35 44.67,33.64 44.45,33.43 43.29,33.43 P1.5
ENC_OUT_B2: length 21.6
  Top Layer w0.254: U1.42 37.37,21 37.39,21.02 37.39,22.01 37.65,22.27 37.65,24.6 v1(37.7,24.65)
  Bottom Layer w0.305: v1(37.7,24.65) 37.95,24.65 38.34,24.26 40.91,24.26 41.29,24.65 42.74,24.65 48.53,30.44 48.53,32.22 47.26,33.49 P2.5
IR_S_IN1: length 67.7
  Top Layer w0.254: U1.59 32.32,13.95 32.3,13.93 31.34,13.93 31.27,13.86 28.94,13.86 28.79,13.71 27.98,13.71 v1(27.93,13.66)
  Top Layer w0.305: v1(13.38,57.16) 13.39,57.15 R50.1
  Top Layer w0.508: R50.1 15.41,59.05 R49.1
  Inner2 w0.305: v1(13.38,57.16) 12.6,56.39 12.6,55 13.08,54.52 13.08,53.61 12.6,53.12 12.6,15.26 12.82,15.05 16.88,15.05 17.19,14.74 18.08,14.74 19.17,13.66 22.44,13.66 22.93,13.17 23.43,13.17 23.92,13.66 26.66,13.66 26.78,13.54 27.28,13.54 27.4,13.66 v1(27.93,13.66)
IR_S_IN2: length 93
  Top Layer w0.305: v1(33.72,8.13) 33.73,8.15 34.55,8.15 34.87,8.46 U1.2 ; v1(73.02,60.16) 72.47,59.61 R57.1
  Top Layer w0.508: R58.1 72.52,58.84 R57.1
  Inner2 w0.305: v1(73.02,60.16) 76.92,56.26 76.92,53.61 78.05,52.48 78.05,28.66 59.05,9.66 51.04,9.66 50.99,9.71 50.33,9.71 50.28,9.66 44.21,9.66 44.21,9.67 40.79,9.67 39.25,8.13 v1(33.72,8.13)
IR_S_IN3: length 57.7
  Top Layer w0.254: v1(29.89,19.18) 29.94,19.13 30.13,19.13 31.29,17.97 32.25,17.97 32.27,17.95 U1.51
  Top Layer w0.305: v1(29.79,63.77) 29.83,63.72 R60.1
  Top Layer w0.508: R60.1 31.83,63.78 R59.1
  Inner2 w0.305: v1(29.89,19.18) 25.01,24.06 25.01,53.25 25.52,53.76 25.52,54.27 25.01,54.77 25.01,58.99 v1(29.79,63.77)
IR_S_IN4: length 77.6
  Top Layer w0.254: v1(30.03,18.21) 30.14,18.11 30.64,18.11 31.3,17.45 U1.52
  Top Layer w0.305: v1(55.19,66.97) 55.11,67.04 54.28,67.04
  Top Layer w0.508: R61.1 54.28,65.49 R62.1
  Inner2 w0.305: v1(55.19,66.97) 55.85,66.31 55.85,58.62 57.17,57.3 57.17,28.02 49.58,20.43 v1(46.14,20.43)
  Bottom Layer w0.305: v1(46.14,20.43) 32.71,20.43 31.91,19.63 31.45,19.63 v1(30.03,18.21)
IR_S_IN5: length 80.2
  Top Layer w0.305: v1(47.72,78.09) 47.71,78.1 R63.1 ; v1(37.25,17.57) 38.77,16.04 38.77,13.46 38.87,13.36 U1.10
  Top Layer w0.508: R64.1 R63.1
  Inner2 w0.305: v1(47.72,78.09) 40.81,71.18 40.81,56.19 39.43,54.81 39.43,45.55 38.62,44.75 38.62,27.61 40.05,26.18 40.05,25.93 40.51,25.48 40.91,25.48 41.27,25.12 41.27,21.58 v1(37.25,17.57)
IR_S_IN6: length 78.2
  Top Layer w0.305: v1(40.86,18.74) 39.37,17.25 U1.11 ; v1(42.54,66.36) 41.14,67.75 41.14,69.99 41.78,70.62 R65.1
  Top Layer w0.508: R66.1 R65.1
  Inner2 w0.305: v1(42.54,66.36) 42.03,65.85 42.03,27.08 44.89,24.22 44.89,20.95 44.29,20.36 42.48,20.36 v1(40.86,18.74)
IR_S_OUT1: length 103.3
  Top Layer w0.254: v1(42.93,7.39) 42.79,7.39 42.64,7.55 41.57,7.55 40.88,8.24 40.88,9.31 40.87,9.32 U1.14
  Top Layer w0.305: v1(14.04,55.64) 14.05,55.65 R50.2
  Top Layer w0.508: U13.2 7.94,51.63 12.41,51.63 14.04,53.25 14.04,54.28 R50.2
  Inner2 w0.305: v1(14.04,55.64) 13.63,56.05 13.63,56.55 13.99,56.91 13.99,57.41 13.63,57.77 13.12,57.77 12.77,57.41 12.77,57.13 12.2,56.56 12.2,56.39 12.16,56.35 12.16,55.8 10.88,54.52 10.88,53.61 12.2,52.29 12.2,15.1 12.95,14.34 17.9,14.34 27.09,5.15 28.83,5.15 29.55,4.43 42.59,4.43 42.93,4.77 v1(42.93,7.39)
IR_S_OUT2: length 92.4
  Top Layer w0.305: 74.38,56.1 v1(75.56,56.1) ; v1(41.39,11.34) 41.37,11.32 U1.15
  Top Layer w0.508: U15.2 86.73,54.06 84.7,52.03 77.64,52.03 75.76,53.91 75.76,54.72 74.38,56.1 R58.2
  Inner2 w0.305: v1(41.39,11.34) 42.23,10.5 42.23,10.38 42.45,10.16 50.55,10.16 51.33,10.93 51.83,10.93 52.61,10.16 56.84,10.16 57.72,11.04 59.85,11.04 77.59,28.78 77.59,52.36 76.51,53.44 76.51,55.14 v1(75.56,56.1)
IR_S_OUT3: length 77.1
  Top Layer w0.254: v1(47.92,11.45) 47.87,11.5 46.71,11.5 46.44,11.77 46.34,11.77 45.18,12.93 43.99,12.93 43.97,12.95 U1.20
  Top Layer w0.305: v1(48.23,24.35) 33.55,39.03 33.55,45.43 v1(29.63,49.34) ; R60.2 27.76,62.34 v1(27.25,62.34)
  Top Layer w0.508: U17.2 28.32,65.3 R60.2
  Bottom Layer w0.305: v1(29.63,49.34) 29.13,49.34 28.72,49.75 28.72,60.87 v1(27.25,62.34) ; v1(47.92,11.45) 48.23,11.76 48.23,13.83 47.97,14.08 47.45,14.08 46.6,14.94 46.57,14.94 44.82,16.68 44.82,18.2 45.18,18.56 46.55,18.56 47.62,19.63 47.62,22.87 47.01,23.48 47.01,23.99 47.36,24.35 48.23,24.35
IR_S_OUT4: length 67.6
  Top Layer w0.254: U1.26 v1(46.99,15.95)
  Top Layer w0.305: R62.2 55.74,64.79 v1(56.46,64.07)
  Top Layer w0.508: R62.2 65.24,65.44 U19.2
  Inner2 w0.305: v1(46.99,15.95) 46.99,17.26 57.57,27.85 57.57,57.47 57.37,57.67 57.37,58.18 57.57,58.38 57.57,62.95 v1(56.46,64.07)
IR_S_OUT5: length 86.7
  Top Layer w0.305: U1.9 38.37,12.45 v1(38.1,12.71) ; R64.2 51.01,79.15 v1(50.97,79.11)
  Top Layer w0.508: U21.2 49.24,83.53 51.01,81.76 R64.2
  Inner2 w0.305: v1(38.1,12.71) 38.1,17.57 41.3,20.76 44.12,20.76 44.48,21.12 44.48,22.48 41.08,25.89 40.92,25.89 39.03,27.77 39.03,44.58 41.62,47.17 41.62,69.76 v1(50.97,79.11)
IR_S_OUT6: length 91
  Top Layer w0.305: R66.2 38.43,75.61 v1(38.37,75.55) ; v1(37.14,18.74) 37.14,18.31 36.64,17.82 36.64,13.31 37.87,12.08 37.87,11.35 37.93,11.29 37.93,10.79 37.87,10.73 U1.8
  Top Layer w0.508: U23.2 38.43,90.04 R66.2
  Inner2 w0.305: v1(38.37,75.55) 34.26,71.44 34.26,26.58 33.1,25.42 33.1,22.22 34.26,21.06 v1(34.26,18.35)
  Bottom Layer w0.305: v1(37.14,18.74) 34.65,18.74 v1(34.26,18.35)
LED1: length 2.9
  Top Layer w0.305: R72.1 74.21,1.91 U3.2
LED2: length 3.1
  Top Layer w0.305: U3.3 75.48,2.38 R73.1
LED3: length 39.9
  Top Layer w0.305: LED13.1 71.61,1.74 72.19,1.16 76.5,1.16 76.68,1.33 76.68,4.7 U3.4 77.69,3.83 v1(77.69,3.16) ; LED10.2 53.95,1.74 54.95,0.74 56.2,0.74 57.21,1.74 LED12.2 58.9,1.74 59.9,0.74 64.01,0.74 64.19,0.91 64.19,1.5 64.43,1.74 LED11.1 66.1,1.74 v1(66.76,1.08)
  Bottom Layer w0.305: v1(66.76,1.08) 66.76,0.79 66.97,0.57 75.1,0.57 v1(77.69,3.16)
LIPO+: length 29.8
  Top Layer w0.75: C50.2 70.25,7.01 69.99,7.01 69.6,7.4 69.6,7.66 68.55,8.71 v2(68.55,11.39) ; U3.6 75.48,10.68 76.4,11.6 79.47,11.6 v2(79.52,11.65)
  Top Layer w1.001: C51.2 69.93,12.78 v2(68.55,11.39) 68.35,11.19 L1.1 ; F2.1 v2(79.52,11.65)
  Bottom Layer w1.001: v2(68.55,11.39) 79.26,11.39 v2(79.52,11.65)
M_AIN1: length 41.8
  Top Layer w0.254: v1(36.93,23.63) 36.88,23.58 36.88,21.98 36.89,21.98 36.89,21.02 36.87,21 U1.43
  Top Layer w0.305: U10.21 40,59.45 39.13,58.58 v1(38.73,58.58)
  Inner2 w0.305: v1(36.93,23.63) 36.93,56.79 v1(38.73,58.58)
M_AIN2: length 41.9
  Top Layer w0.254: v1(39.04,25.76) 38.99,25.7 38.99,22.55 38.39,21.95 38.39,20.97 U1.40
  Top Layer w0.305: U10.22 40.31,58.8 v1(39.34,57.82)
  Inner2 w0.305: v1(39.34,57.82) 38.78,57.82 38.37,57.42 38.22,57.42 37.35,56.55 37.35,27.44 v1(39.04,25.76)
M_AO1: length 21
  Top Layer w0.305: 48.89,58.15 47.69,58.15 v2(47.31,57.77) 47.58,57.5 48.89,57.5
  Top Layer w0.75: v2(40.33,50.08) 38.52,51.88 R88.1 R90.1
  Bottom Layer w0.75: v2(40.33,50.08) 47.31,57.06 v2(47.31,57.77)
M_AO2: length 49.7
  Top Layer w0.305: 48.89,60.1 51.47,60.1 v2(51.73,60.36) 51.53,60.57 49.95,60.57 49.77,60.75 48.89,60.75
  Top Layer w0.75: v2(38.62,45.88) 38.62,45.71 P1.2
  Bottom Layer w0.75: v2(51.73,60.36) 40.11,60.36 39.43,61.04 38.8,61.04 36.41,63.43 35.66,63.43 34.51,62.28 34.51,61.53 37.64,58.4 37.64,48.44 38.62,47.45 v2(38.62,45.88)
M_BIN1: length 70.8
  Top Layer w0.254: v1(28.28,14.82) 28.33,14.87 31.18,14.87 31.24,14.93 32.19,14.93 32.21,14.95 U1.57
  Top Layer w0.305: v1(43.04,62.45) 42.65,62.05 U10.17
  Inner2 w0.305: v1(35.12,59.65) 35.12,26.87 33.5,25.25 33.5,22.39 35.12,20.78 35.12,18.1 31.84,14.82 v1(28.28,14.82)
  Bottom Layer w0.305: v1(35.12,59.65) 35.12,60.03 33.88,61.27 33.88,62.54 35.4,64.06 36.67,64.06 38.54,62.19 40.4,62.19 40.66,62.45 v1(43.04,62.45)
M_BIN2: length 45.7
  Top Layer w0.254: U1.39 38.89,20.97 38.89,21.95 39.76,22.82 39.76,25.26 v1(39.82,25.31)
  Top Layer w0.305: v1(40.15,62.8) 40.25,62.7 U10.16
  Inner2 w0.305: v1(39.82,25.31) 39.65,25.48 39.65,26.01 37.81,27.84 37.81,55.18 39.89,57.26 39.89,57.52 39.95,57.57 39.95,58.08 39.89,58.13 39.89,62.55 v1(40.15,62.8)
M_BO1: length 20.7
  Top Layer w0.305: 48.89,64 50.03,64 v2(50.36,64.33) 50.04,64.65 48.89,64.65
  Top Layer w0.75: R91.1 v2(52.3,53.43) R89.1
  Bottom Layer w0.75: 52.3,53.62 52.3,55.29 55.08,58.08 55.08,60.41 51.17,64.33 v2(50.36,64.33)
M_BO2: length 49.8
  Top Layer w0.305: 48.89,62.05 50.5,62.05 50.51,62.04 ; 50.51,61.38 50.49,61.4 48.89,61.4
  Top Layer w0.75: 50.51,61.38 50.51,62.04 51.98,63.51 v2(54.63,63.51) ; v2(50.97,46.49) 50.97,45.43 P2.2
  Bottom Layer w0.75: v2(54.63,63.51) 59.35,58.79 59.35,57.17 61.32,55.2 65.08,55.2 65.57,54.71 65.57,54.02 58.91,47.37 51.85,47.37 v2(50.97,46.49)
M_CURR1_IN: length 3.9
  Top Layer w0.75: U25.1 U25.2 33.24,51.65 33.48,51.89 34.56,51.89 R88.2
M_CURR1_OUT: length 16.5
  Top Layer w0.75: 43.65,47.15 43.65,48.32 37.79,54.19 U25.4 U25.3
M_CURR2_IN: length 4.8
  Top Layer w0.75: R89.2 54.93,54.98 U26.1 U26.2
M_CURR2_OUT: length 13.2
  Top Layer w0.75: v1(56.35,48.22) 56.63,48.5 U26.4 U26.3
  Bottom Layer w0.75: v1(56.35,48.22) 47.26,48.22 U29.2
M_PWMA: length 82.4
  Top Layer w0.254: v1(27.21,12.23) 27.26,12.28 29.55,12.28 30.21,12.94 32.31,12.94 32.32,12.95 U1.61
  Top Layer w0.305: v1(43.31,63.31) 43.31,63.04 43.65,62.7 43.65,61.15 43.31,60.8 43.31,58.34 43.1,58.13 42.79,58.13 42.77,58.15 U10.23
  Inner2 w0.305: v1(27.21,12.23) 30.02,12.23 30.35,12.56 30.9,12.56 36.12,17.78 36.12,20.64 34.9,21.86 34.61,21.86 33.91,22.56 33.91,25.09 35.78,26.96 v1(35.78,58.23)
  Bottom Layer w0.305: v1(43.31,63.31) 41.37,63.31 40.21,64.47 35.23,64.47 33.47,62.71 33.47,61.1 34.51,60.07 34.51,59.4 35.68,58.23 v1(35.78,58.23)
M_PWMB: length 70.2
  Top Layer w0.254: v1(27.6,11.49) 29.31,11.49 30.36,12.54 30.84,12.54 30.92,12.45 U1.62
  Top Layer w0.305: U10.15 40.46,63.35 v1(40.1,63.72)
  Inner2 w0.305: v1(40.1,63.72) 36.53,60.15 36.53,27.13 34.32,24.92 34.32,23.77 34.67,23.41 35.18,23.41 36.53,22.06 36.53,14.43 33.44,11.34 30.35,11.34 30.2,11.49 v1(27.6,11.49)
OSC_8M_O1: length 13.9
  Top Layer w0.254: C80.2 31.81,3.21 X3.1 36.06,3.21 36.24,3.39 36.24,6.45 36.41,6.63 36.41,8.15 36.37,8.2 U1.5
OSC_8M_O2: length 14
  Top Layer w0.254: C79.2 41.02,3.21 X3.2 36.82,3.21 36.64,3.39 36.64,6.28 36.82,6.46 36.82,8.15 36.87,8.2 U1.6
PA5: length 50.3
  Top Layer w0.305: v1(41.93,15.96) 41.93,15.39 42.56,14.76 42.56,13.76 42.83,13.5 43.82,13.5 U1.21
  Bottom Layer w0.305: v1(41.93,15.96) 35.05,15.96 34.56,15.47 34.56,14.81 35.03,14.33 35.03,12.67 28.57,6.21 3.98,6.21 H2.1
PB6: length 28.4
  Top Layer w0.254: v1(27.03,14.15) 27.08,14.2 27.6,14.2 27.69,14.29 27.98,14.29 28.03,14.24 28.52,14.24 28.57,14.29 31.04,14.29 31.19,14.43 32.3,14.43 32.32,14.45 U1.58 ; v1(22.32,11.44) 22.02,11.15 21.83,11.15 21.53,10.84 18.82,10.84 17.45,9.47 15.72,9.47 15.21,8.96 9.41,8.96 8.04,7.59 7.68,7.59 7.59,7.68
  Bottom Layer w0.254: v1(27.03,14.15) 26.43,14.74 25.32,14.74 22.67,12.1 22.67,11.8 v1(22.32,11.44)
PB10: length 40.9
  Top Layer w0.305: U1.29 42.3,17.45 v1(41.77,16.93)
  Bottom Layer w0.305: v1(41.77,16.93) 41.27,16.42 34.93,16.42 34.15,15.64 34.15,14.64 34.62,14.17 34.62,12.88 28.46,6.72 11.55,6.72 10.58,7.68 H2.4
PB12: length 56.4
  Top Layer w0.254: U1.33 42.29,21.37 v1(43.87,21.37) 43.87,25.48 40.23,29.12 18.26,29.12 16.17,27.03 16.17,24.85 12.06,20.73 12.06,20.07 11.1,19.11 3.78,19.11 2.71,18.05 H3.1
PB13: length 52.4
  Top Layer w0.254: U1.34 41.39,20.97 41.39,21.93 41.69,22.23 42.04,22.23 42.1,22.18 43.12,22.18 v1(43.17,22.23) 43.17,22.63 43.47,22.92 43.47,25.38 40.08,28.77 18.41,28.77 16.53,26.89 16.53,24.7 12.62,20.79 12.62,20.78 12.41,20.58 12.41,19.92 11.25,18.76 7.33,18.76 5.4,16.83 H3.2
PB14: length 47.4
  Top Layer w0.254: H3.3 9.36,18.4 11.4,18.4 12.77,19.77 12.77,20.43 13.73,21.39 13.73,21.4 16.2,23.86 23.62,23.86 28.16,28.41 39.94,28.41 42.88,25.46 v1(42.88,23.16) 42.83,23.11 42.83,22.97 42.45,22.59 41.54,22.59 40.89,21.93 40.89,21.02 40.87,21 U1.35
PB15: length 43.5
  Top Layer w0.254: U1.36 40.37,21 40.39,21.02 40.39,21.94 41.68,23.22 41.68,23.28 41.74,23.34 v1(42.09,23.34) 42.09,25.35 41.62,25.82 41.62,26.22 39.79,28.05 28.31,28.05 23.77,23.51 16.35,23.51 13.12,20.28 13.12,19.62 H3.4
PC12: length 32.6
  Top Layer w0.254: U1.53 32.34,16.92 31.33,16.92 30.9,17.35 29.65,17.35 v1(29.55,17.45) ; v1(21.56,11.7) 21.15,11.29 18.77,11.29 17.4,9.92 15.67,9.92 15.16,9.41 9.31,9.41 8.86,8.95 6.32,8.95 H2.2
  Bottom Layer w0.254: v1(21.56,11.7) 22.52,12.66 22.52,14.34 24.6,16.42 27.3,16.42 28.33,17.45 v1(29.55,17.45)
ST_LED1: length 17.3
  Top Layer w0.254: U1.44 36.37,21 36.35,21.02 36.35,21.98 36.3,22.02 36.3,24.29 v1(36.25,24.34)
  Top Layer w0.305: 36.24,24.38 36.24,25.26 35.76,25.74 32.83,25.74 27.85,20.76 26.95,20.76 25.92,21.79
ST_LED2: length 15.8
  Top Layer w0.254: U1.45 35.87,23.42 35.51,23.78 35.51,24.26 35.38,24.4 v1(35.38,25.12)
  Top Layer w0.305: 25.94,19.97 27.85,19.97 33.03,25.15 35.27,25.15
ST_LED3: length 6.9
  Top Layer w0.254: v1(28.7,16.79) 29.02,16.47 32.25,16.47 32.27,16.45 U1.54
  Top Layer w0.305: 25.91,17.63 27.85,17.63 v1(28.7,16.79)
STLINK_JTDI: length 31.9
  Top Layer w0.254: U1.50 32.34,18.42 31.34,18.42 31.09,18.67 31.09,19.63 30.81,19.9 30.39,19.9 v1(30.29,20.01) ; v1(21.86,13.02) 18.56,13.02 17.2,11.66 17.2,11.56 16.15,10.52 10.59,10.52 8.8,12.31 P3.3
  Bottom Layer w0.254: v1(21.86,13.02) 21.86,13.98 22.17,14.29 22.17,14.49 24.46,16.78 26.99,16.78 28.11,17.89 28.11,19.06 29.05,20.01 v1(30.29,20.01)
STLINK_NJTRST: length 21.9
  Top Layer w0.254: P3.5 13.88,12.31 14.96,11.23 15.86,11.23 16.49,11.86 16.49,12.12 18.81,14.44 24.1,14.44 v1(24.35,14.69) ; U1.56 29.57,15.45 29.49,15.37 29.01,15.37 28.97,15.4 28.53,15.4 28.52,15.41 28.03,15.41 28.03,15.4 v1(27.64,15.4)
  Bottom Layer w0.254: v1(27.64,15.4) 25.06,15.4 v1(24.35,14.69)
STLINK_NRST: length 31.5
  Top Layer w0.305: 19.53,7.96 19.57,7.93 22.06,7.93 ; v1(33.5,9.4) 32.79,8.68 31.57,8.68 31.34,8.45 29.95,8.45 29.73,8.68 23.05,8.68 22.36,7.99 ; 16.72,7.96 16.78,7.9 19.4,7.9 ; 16.32,7.86 15.54,7.08 13.94,7.08 13.76,6.9 13.76,5.31 11.17,2.72 10.5,2.72 ; 37.36,10.06 37.36,10.96 37.3,11.02
  Bottom Layer w0.305: v1(37.32,11.04) 35.14,11.04 v1(33.5,9.4)
STLINK_RX: length 51.4
  Top Layer w0.305: 7.93,2.43 7.93,2.31 9.1,1.14 11.37,1.14 14.19,3.96 v1(17.04,3.96) ; v1(46.39,5.96) 46.39,9.01 43.97,11.43
  Bottom Layer w0.305: 46.39,5.95 46.39,3.4 44.04,1.06 27.76,1.06 24.86,3.96 v1(17.04,3.96)
STLINK_SWO: length 25.4
  Top Layer w0.254: U1.55 32.36,15.94 29.61,15.94 29.49,15.82 29.01,15.82 28.88,15.94 28.27,15.94 v1(28.22,15.99) ; P3.4 11.76,10.87 16,10.87 16.84,11.71 16.84,11.97 18.66,13.78 v1(23.18,13.78)
  Bottom Layer w0.254: v1(28.22,15.99) 24.82,15.99 23.77,14.94 23.77,14.36 v1(23.18,13.78)
STLINK_TCK: length 32.5
  Top Layer w0.254: P3.2 6.26,12.31 7.34,13.39 15.47,13.39 v1(17.44,15.35) ; U1.49 31.65,19.66 v1(31.65,20.24)
  Bottom Layer w0.254: v1(31.65,20.24) 30.89,20.24 30.53,20.59 29.13,20.59 27.75,19.21 27.75,18.25 26.64,17.13 24.31,17.13 22.12,14.95 17.85,14.95 v1(17.44,15.35)
STLINK_TMS: length 41.3
  Top Layer w0.254: P3.1 3.72,12.31 5.16,13.74 14.76,13.74 v1(17.39,16.37) ; v1(34.93,24.02) 34.93,23.23 35.45,22.71 35.45,22.22 35.37,22.14 U1.46
  Bottom Layer w0.254: v1(34.93,24.02) 31.9,20.99 29.03,20.99 27.4,19.36 27.4,18.4 26.48,17.49 24.16,17.49 22.64,15.96 17.8,15.96 v1(17.39,16.37)
STLINK_TX: length 58.5
  Top Layer w0.305: v1(43.03,9.06) 42.49,9.6 42.49,10.58 42.18,10.88 41.93,10.88 41.87,10.82 U1.16 ; 15.92,3.56 14.36,3.56 11.47,0.67 6.61,0.67 4.73,2.55 ; 15.93,3.56 16.2,3.28 v1(18.25,3.28)
  Bottom Layer w0.305: v1(18.25,3.28) 24.97,3.28 27.59,0.65 44.21,0.65 47.09,3.53 47.09,3.65 ; 43.1,9.1 44.3,9.1 47.11,6.29 47.11,3.68
UART_RX: length 37.2
  Top Layer w0.254: v1(40.66,24.87) 40.66,23.21 39.37,21.92 U1.38
  Top Layer w0.305: 40.67,24.93 40.67,26.04 40.04,26.68 36.66,26.68 36.18,26.19 32.65,26.19 29.23,22.77 18.51,22.77 17.8,22.06 17.8,19.06 16.37,17.64 U11.1
UART_TX: length 35.6
  Top Layer w0.254: U1.37 39.94,21.02 39.94,21.99 41.27,23.32 41.27,26.07 40.28,27.06 36.5,27.06 36.02,26.57 32.49,26.57 29.07,23.15 18.35,23.15 17.42,22.22 17.42,21.93 16.93,21.45 16.07,21.45 U11.2
$2N727: length 9.8
  Top Layer w0.508: USB1.2 81.97,6.97 82.23,7.23 84.75,7.23 85.44,7.91 F1.1 86.77,8.13 USB1.11
$2N1809: length 10.4
  Top Layer w0.75: U3.1 72.94,3.85 72.41,3.31 71.51,3.31 71.45,3.37 66.2,3.37 65.35,4.23 L1.2
$2N1982: length 2
  Top Layer w0.75: R71.2 78.17,10.14 U3.5
$2N3514: length 9.7
  Top Layer w0.75: v1(67.89,12.46) 67.89,13.08 R51.1 ; SW1.1 v1(66.41,18.96)
  Bottom Layer w0.75: v1(67.89,12.46) 66.41,13.93 v1(66.41,18.96)
$2N3591: length 14
  Top Layer w0.508: v1(55.59,13.37) R70.1 ; SW1.2 65.45,17.49 v1(65.14,17.79)
  Bottom Layer w0.508: v1(55.59,13.37) 60.72,13.37 v1(65.14,17.79)
$2N3818: length 8.5
  Top Layer w0.508: U31.1 51.84,14.44 R70.2 52.95,13.37 54.02,14.44 54.18,14.44 C74.2 55.54,14.61 55.54,14.58 55.77,14.35 55.8,14.35 56.46,13.69 R68.2
$2N3895: length 35.3
  Top Layer w0.5: R69.2 55.45,16.22 56.1,16.22 56.31,16.42 U4.5
  Top Layer w1.27: 70.78,19.44 70.86,19.52 74.85,19.52 75.16,19.2 C10.2 C9.2 ; 70.78,19.44 70.78,21.23 C11.2 ; 70.78,19.44 L3.2 ; 68.55,15.25 68.29,15.25 67.41,16.13 64.31,16.13 62.88,17.56 62.02,17.56 60.91,18.67 57.42,18.67 57.28,18.53 U4.9 ; 68.55,15.25 R51.2 ; 68.55,15.25 L2.2 70.83,17.69 L3.2 ; L3.2 70.54,17.98 D2.1
$2N3927: length 7
  Top Layer w0.305: 56.31,20.1 56.31,20.69 56.15,20.84 55.74,20.84 55.53,20.63 55.53,19.16 54.81,18.44
  Top Layer w0.75: U31.3 54.44,18.44 R69.1
$2N4136: length 13
  Top Layer w0.305: LED12.1 LED11.2 63.53,1.89 64,1.89 64.86,2.74 71.19,2.74 72.04,1.89 R72.2
$2N4144: length 24.3
  Top Layer w0.305: v1(66.87,1.94) 67.07,1.74 LED13.2 68.46,0.69 68.7,0.45 76.37,0.45 77.09,1.17 77.09,1.5 R73.2 ; LED10.1 56.19,2.35 v1(57.01,2.35)
  Bottom Layer w0.305: v1(57.01,2.35) 66.46,2.35 v1(66.87,1.94)
$2N5035: length 2.6
  Top Layer w0.75: R9.1 54.06,20.14 52.81,21.38 52.59,21.38
$2N10613: length 8.4
  Top Layer w0.299: R74.2 89.37,7.16 89.37,6.7 89.55,6.53 89.55,4.92 89.05,4.42 87.12,4.42 86.61,4.93 86.61,5.18 86.19,5.6 86.19,6.2 USB1.10
$2N10619: length 6.6
  Top Layer w0.305: R75.2 79.35,3.97 82.26,3.97 83.13,4.84 83.13,6.27 USB1.4
$3N1651: length 12.9
  Top Layer w0.254: U1.13 40.37,9.32 40.37,9.32 40.37,8.24 41.74,6.88 41.9,6.88 ; 41.93,6.91 v1(41.97,6.94)
  Top Layer w0.305: 41.97,6.87 42.59,6.87 42.68,6.78 44.91,6.78 45.52,6.18 45.52,5.83 46,5.35 50.72,5.35
$3N1929: length 6.8
  Top Layer w0.508: R77.2 30.35,60.16 26.79,60.16 SW2.3
$3N2172: length 2.3
  Top Layer w0.508: SW3.3 60.52,56.55 R78.2
$3N2375: length 1.8
  Top Layer w0.305: 24.05,6.15 23.82,6.38 23.82,7.84
$3N4904: length 2.5
  Top Layer w0.508: 21.56,21.25 23.46,21.25 23.87,21.65
$3N4908: length 2.9
  Top Layer w0.508: 21.52,18.84 22.36,19.68 24.06,19.68
$3N4913: length 3.1
  Top Layer w0.508: 24.19,17.85 22.76,16.42 22.71,16.42 22.66,16.38 21.69,16.38
$3N7852: length 7.4
  Top Layer w0.305: C84.2 39.95,61.16 39.95,60.56 40.4,60.1 U10.20
  Top Layer w0.508: L5.1 C84.2
$3N11524: length 14.6
  Top Layer w0.75: P2.1 48.53,45.53 48.53,49.34 v2(47.87,50) ; R91.2 53.8,50.8 v2(53.2,50.2)
  Bottom Layer w0.75: v2(53.2,50.2) 53,50 v2(47.87,50)
$3N11535: length 11.8
  Top Layer w0.75: R90.2 34.57,48.98 36.19,47.36 39.51,47.36 P1.1
$7N410: length 9.9
  Top Layer w0.508: R49.2 13.78,60.61 9.44,56.27 U12.2
$7N824: length 7.5
  Top Layer w0.508: U14.2 78.02,56.48 75.61,58.89 R57.2
$7N1016: length 7
  Top Layer w0.508: R59.2 33.33,66.22 29.5,70.06
$7N1208: length 4.7
  Top Layer w0.508: R61.2 58.83,71.49 58.83,71.85
$7N1400: length 13.2
  Top Layer w0.508: R63.2 46.2,89.56 U20.2
$7N1592: length 4.3
  Top Layer w0.508: U22.2 43.29,81.17 R65.2
$7N3107: length 46.5
  Top Layer w0.305: v1(41.01,49.09) 40.71,48.78 v1(38.47,48.78) ; U26.6 62.15,50.71 v1(60.27,50.71) ; R82.1 29.88,55.89 30.62,56.63 38.29,56.63 v1(38.47,56.81)
  Top Layer w0.508: R82.1 28.16,54.41 28.16,53.81 27.27,52.92 U25.6
  Bottom Layer w0.305: v1(60.27,50.71) 58.64,49.09 v1(41.01,49.09) ; v1(38.47,56.81) v1(38.47,48.78)
$7N4059: length 8.4
  Top Layer w0.508: R84.1 15.77,51.98 C76.1 18.71,51.99 R85.1 18.76,50.36 19.47,49.64 20.42,49.64 U27.4
$7N6586: length 7.5
  Top Layer w0.508: U30.4 69.47,52.67 R93.1 73.73,51.26 C82.1 73.83,53.14 R92.1

## Copper pours and planes (outline as drawn; the poured copper is in the pictures)
5V_UP on Top Layer: 81.03,11.21 83.58,11.21 83.58,7.96 81.03,7.96
5V_UP on Top Layer: 82.41,17.56 89.34,17.56 89.34,14.22 82.41,14.22
5V_UP on Bottom Layer: 82.31,17.56 87.29,17.56 87.29,7.7 82.31,7.7
+3V3 on Bottom Layer: 49.6,10.27 59.66,10.27 59.66,5.65 49.6,5.65
+5V on Top Layer: 56.91,22.31 58.64,22.31 58.64,19.7 56.91,19.7
GND on Top Layer: 52.8,6.32 57.78,6.32 57.78,4.43 52.8,4.43
GND on Top Layer: 73.13,8.8 79.06,8.8 79.06,5.97 73.13,5.97
GND on Top Layer: 70.27,11.09 73.32,11.09 73.32,7.68 70.27,7.68
GND on Top Layer: 60.26,10.28 62.05,10.28 62.05,5.66 60.26,5.66
GND on Inner1: 0.26,94.75 89.74,94.75 89.74,0.26 0.26,0.26
$2N19187 on Top Layer: 74.74,17.39 81.3,17.39 81.3,15.1 74.74,15.1

Small or netless copper shapes (teardrops, artwork), in the pictures only: 78 on Inner1

## Text on the board
Top Layer: Viktor Hofer | Designed by | Hardware-Software-Design | FH-Hagenberg | Micro-Mouse
